# Altium project BLDC Motor Driver.PrjPcb (part 2 of 2)

## Sheet User - User Interface.SchDoc: [22] User - User Interface
size A4; ApprovedBy: Nagy Richard; CheckedBy: Nagy Richard; Author: Nagy Richard; CompanyName: EmbedCore; DrawnBy: Nagy Richard; Engineer: Nagy Richard; Organization: EmbedCore; DocumentNumber: 22; Revision: 1.0; SheetNumber: 22; SheetTotal: 22
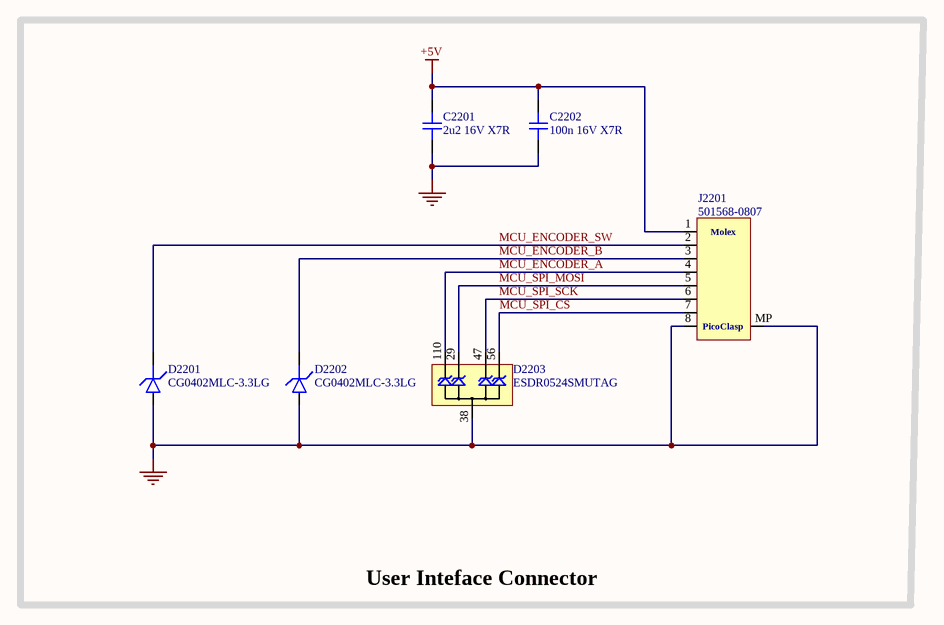
[diagram p19: User - User Interface.SchDoc]

### Parts
C2201  2u2 16V X7R  [CAP_0603]
C2202  100n 16V X7R  [CAP_0402]
D2201  CG0402MLC-3.3LG  [D_0402]
D2202  CG0402MLC-3.3LG  [D_0402]
D2203  ESDR0524SMUTAG  [uDFN-10-WIDE]
J2201  501568-0807  [501568-0807]

### Blocks framed on the sheet
User Inteface Connector: C2201 C2202 D2201-D2203 J2201

### Nets
+5V: C2201.2 C2202.2 J2201.1
GND: C2201.1 C2202.1 D2201.A D2202.A D2203.38(GND) J2201.8 J2201.MP
MCU_ENCODER_A: D2203.110 J2201.4
MCU_ENCODER_B: D2202.K J2201.3
MCU_ENCODER_SW: D2201.K J2201.2
MCU_SPI_CS: D2203.56 J2201.7
MCU_SPI_MOSI: D2203.29 J2201.5
MCU_SPI_SCK: D2203.47 J2201.6

### Notes on the sheet
- Title:
- Drawn By:
- Page Contents:
- Checked By:
- Size:
- Date:
- File:
- License:
- Email:
- A4
- Number:
- Time:
- Revision:
- Sheet
- Website:
- of
- (in symbol 501568-0807) PicoClasp

### Library data of the parts
C2201 = CAP_0603: Capacitor SMD 0603; Manufacturer: YAGEO; Manufacturer Part Number: CC0603KRX7R7BB225; Distributor Link: www.lcsc.com; LCSC: C914769; Rating: *; Dielectric: *
C2202 = CAP_0402: Capacitor SMD 0402; Manufacturer: YAGEO; Manufacturer Part Number: CC0402JRX7R7BB104; Distributor Link: www.lcsc.com; LCSC: C541464; Rating: *; Dielectric: *
D2201 D2202 = D_TVS_0402: Diode TVS / ESD 0402
D2203 = ESDR0524SMUTAG: TVS Diode Array Low Capacitance ESD Protection 4-Channel (Vwork=5V, Vclamp=15V); Manufacturer: onsemi; Manufacturer Part Number: ESDR0524SMUTAG; Distributor Link: https://www.mouser.de/ProductDetail/onsemi/ESDR0524SMUTAG?qs=NJQfjRgVp6Qe%2FuopsuIgOg%3D%3D; LCSC: C890633
J2201 = 501568-0807: 1.00mm Pitch, Pico-Clasp PCB Header, Single Row, Right-Angle, Surface Mount, Tin Plated, Outer Positive Lock, 8 Circuits, Natural; Manufacturer: Molex; Manufacturer Part Number: 501568-0807

## Sheet User - User Led's.SchDoc: [23] User - User Led's
size A4; ApprovedBy: Nagy Richard; CheckedBy: Nagy Richard; Author: Nagy Richard; CompanyName: EmbedCore; DrawnBy: Nagy Richard; Engineer: Nagy Richard; Organization: EmbedCore; DocumentNumber: 23; Revision: 1.0; SheetNumber: 23; SheetTotal: 26
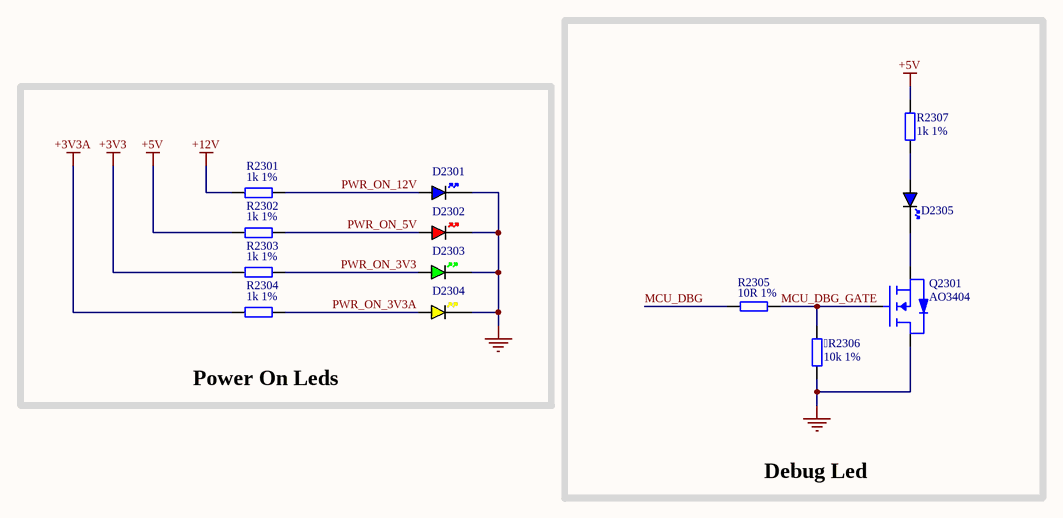
[diagram p20: User - User Led's.SchDoc]

### Parts
R2306  10k 1%  [RES_0402]
D2301  BLUE  [LED_0402_BLUE]  (value not drawn)
D2302  RED  [LED_0402_RED]  (value not drawn)
D2303  GREEN  [LED_0402_GREEN]  (value not drawn)
D2304  YELLOW  [LED_0402_YELLOW]  (value not drawn)
D2305  BLUE  [LED_0402_BLUE]  (value not drawn)
Q2301  AO3404  [SSM3J338R,LF-SOT23-F]
R2301  1k 1%  [RES_0402]
R2302  1k 1%  [RES_0402]
R2303  1k 1%  [RES_0402]
R2304  1k 1%  [RES_0402]
R2305  10R 1%  [RES_0402]
R2307  1k 1%  [RES_0402]

### Blocks framed on the sheet
Debug Led: R2306 D2305 Q2301 R2305 R2307
Power On Leds: D2301-D2304 R2301-R2304

### Nets
+3V3: R2303.1
+3V3A: R2304.1
+5V: R2302.1 R2307.2
+12V: R2301.1
GND: R2306.1 D2301.K D2302.K D2303.K D2304.K Q2301.D
MCU_DBG: R2305.2
MCU_DBG_GATE: R2306.2 Q2301.G R2305.1
PWR_ON_3V3: D2303.A R2303.2
PWR_ON_3V3A: D2304.A R2304.2
PWR_ON_5V: D2302.A R2302.2
PWR_ON_12V: D2301.A R2301.2
NetD2305_A: D2305.A R2307.1
NetD2305_K: D2305.K Q2301.S

### Notes on the sheet
- Title:
- Drawn By:
- Page Contents:
- Checked By:
- Size:
- Date:
- File:
- License:
- Email:
- A4
- Number:
- Time:
- Revision:
- Sheet
- Website:
- of

### Library data of the parts
R2306 = RES_0402: Resistor SMD 0402; Manufacturer: PANASONIC; Manufacturer Part Number: ERJPA2F1002X; Distributor Link: www.lcsc.com; LCSC: C427247
D2301 D2305 = LED_0402_BLUE: LED 0402 BLUE SMD
D2302 = LED_0402_RED: LED 0402 RED SMD
D2303 = LED_0402_GREEN: LED 0402 GREEN SMD
D2304 = LED_0402_YELLOW: LED 0402 YELLOW SMD
Q2301 = 2N7002NXAKR: MOSFET N-Channel Vds=60V Id=300mA with ESD Protection; Manufacturer: TECH PUBLIC; Manufacturer Part Number: AO3404
R2301-R2304 R2307 = RES_0402: Resistor SMD 0402; Manufacturer: PANASONIC; Manufacturer Part Number: ERJPA2J102X; Distributor Link: www.lcsc.com; LCSC: C427210
R2305 = RES_0402: Resistor SMD 0402; Manufacturer: PANASONIC; Manufacturer Part Number: ERJPA2J100X; Distributor Link: www.lcsc.com; LCSC: C427198

## Sheet Misc - Holes, Fiducials.SchDoc: [24] Misc - Holes, Fiducials
size A4; ApprovedBy: Nagy Richard; CheckedBy: Nagy Richard; Author: Nagy Richard; CompanyName: EmbedCore; DrawnBy: Nagy Richard; Engineer: Nagy Richard; Organization: EmbedCore; DocumentNumber: 24; Revision: 1.0; SheetNumber: 24; SheetTotal: 25
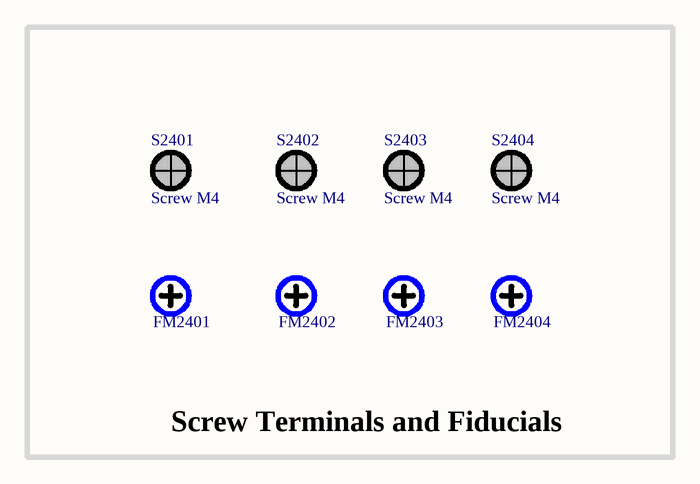
[diagram p21: Misc - Holes, Fiducials.SchDoc]

### Parts
FM2401  Fiducial Marker  [FIDUCIAL_CROSS_1MM5]  (value not drawn)  (no BOM)
FM2402  Fiducial Marker  [FIDUCIAL_CROSS_1MM5]  (value not drawn)  (no BOM)
FM2403  Fiducial Marker  [FIDUCIAL_CROSS_1MM5]  (value not drawn)  (no BOM)
FM2404  Fiducial Marker  [FIDUCIAL_CROSS_1MM5]  (value not drawn)  (no BOM)
S2401  Screw M4  [Screw M4]
S2402  Screw M4  [Screw M4]
S2403  Screw M4  [Screw M4]
S2404  Screw M4  [Screw M4]

### Blocks framed on the sheet
Screw Terminals and Fiducials: FM2401-FM2404 S2401-S2404

### Notes on the sheet
- Title:
- Drawn By:
- Page Contents:
- Checked By:
- Size:
- Date:
- File:
- License:
- Email:
- A4
- Number:
- Time:
- Revision:
- Sheet
- Website:
- of

### Library data of the parts
FM2401-FM2404 = FIDUCIAL_CROSS_1MM5: Fiducial Marker Cross 1.5mm NO BOM

## Sheet Power - Sequencing.SchDoc: [25] Power - Sequencing
size A4; ApprovedBy: Nagy Richard; CheckedBy: Nagy Richard; Author: Nagy Richard; CompanyName: EmbedCore; DrawnBy: Nagy Richard; Engineer: Nagy Richard; Organization: EmbedCore; DocumentNumber: 25; Revision: 1.0; SheetNumber: 23; SheetTotal: 24

### Notes on the sheet
- Title:
- Drawn By:
- Page Contents:
- Checked By:
- Size:
- Date:
- File:
- License:
- Email:
- A4
- Number:
- Time:
- Revision:
- Sheet
- Website:
- of

## Sheet Revision History.SchDoc: [25] Revision History
size A4; ApprovedBy: Nagy Richard; CheckedBy: Nagy Richard; Author: Nagy Richard; CompanyName: EmbedCore; DrawnBy: Nagy Richard; Engineer: Nagy Richard; Organization: EmbedCore; DocumentNumber: 25; Revision: 1.0; SheetNumber: 26; SheetTotal: 26

### Notes on the sheet
- Title:
- Drawn By:
- Page Contents:
- Checked By:
- Size:
- Date:
- File:
- License:
- Email:
- A4
- Number:
- Time:
- Revision:
- Sheet
- Website:
- of

## Nets that join several sheets
+3V3: Power Generation - Buck Converter (5 pins), MCU - Power and I_O (12 pins), Motor Control - Top Level (6 pins), Sensing - HAL Sensor (6 pins), Interface - RS485 (5 pins), Interface - CAN (C1701.2 C1702.2 U1701.3), Interface - SWD (D1901.K J1901.1), User - User Led's (R2303.1)
+3V3A: Power Generation - LDO (C605.1 U601.5), MCU - Power and I_O (C711.2 FB701.2), Sensing - Temperature (D1301.K D1302.K), User - User Led's (R2304.1)
+5V: Power Generation - Buck Converter (7 pins), Power Generation - LDO (C601.1 FB601.1), Sensing - HAL Sensor (C1501.2 C1502.2 J1501.1), Interface - Fan Control (6 pins), User - User Interface (C2201.2 C2202.2 J2201.1), User - User Led's (R2302.1 R2307.2)
+12V: Power Generation - Buck Converter (5 pins), Interface - Fan Control (6 pins), User - User Led's (R2301.1)
+VIN: Power Generation - Connector (D401.1 J401.1), Power Generation - Buck Converter (C501.2 C509.2 FB501.1 FB502.1), Motor Control - Top Level (5 pins), Motor Control - Phase A (C903.2 C904.2 Q901.D R904.2), Motor Control - Phase B (C1003.2 C1004.2 Q1001.D R1004.2), Motor Control - Phase C (C1103.2 C1104.2 Q1101.D R1104.2), Sensing - Voltage (R1201.2), Sensing - Temperature (J1301.1 R1301.2)
GND: Power Generation - Connector (D401.2 J401.2), Power Generation - Buck Converter (32 pins), Power Generation - LDO (6 pins), MCU - Power and I_O (16 pins), Motor Control - Top Level (12 pins), Motor Control - Phase A (C904.1 D903.A NT903.1 R903.1), Motor Control - Phase B (C1004.1 D1003.A NT1003.1 R1003.1), Motor Control - Phase C (C1104.1 D1103.A NT1103.1 R1103.1), Sensing - Voltage (C1201.1 R1202.1), Sensing - Temperature (6 pins), Sensing - HAL Sensor (11 pins), Interface - RS485 (11 pins), Interface - CAN (12 pins), Interface - USB-C (7 pins), Interface - SWD (D1901.A D1902.38 J1901.5), Interface - Fan Control (18 pins), User - User Interface (7 pins), User - User Led's (6 pins)
CAN_DP_N: MCU - Power and I_O (U701.58), Interface - CAN (U1701.4)
CAN_DP_P: MCU - Power and I_O (U701.59), Interface - CAN (U1701.1)
CAN_S: MCU - Power and I_O (U701.60), Interface - CAN (R1701.2 U1701.5)
CAN_SHDN: MCU - Power and I_O (U701.57), Interface - CAN (R1702.2 U1701.8)
ELEC_FAN_PWM: MCU - Power and I_O (U701.10), Interface - Fan Control (U2002.3)
HAL_MCU_A: MCU - Power and I_O (U701.39), Sensing - HAL Sensor (C1503.2 D1504.A R1501.1 R1504.1)
HAL_MCU_B: MCU - Power and I_O (U701.38), Sensing - HAL Sensor (C1504.2 D1505.A R1502.1 R1505.1)
HAL_MCU_C: MCU - Power and I_O (U701.37), Sensing - HAL Sensor (C1505.2 D1506.A R1503.1 R1506.1)
MCU_DBG: MCU - Power and I_O (U701.2), User - User Led's (R2305.2)
MCU_ENCODER_A: MCU - Power and I_O (U701.53), User - User Interface (D2203.110 J2201.4)
MCU_ENCODER_B: MCU - Power and I_O (U701.41), User - User Interface (D2202.K J2201.3)
MCU_ENCODER_SW: MCU - Power and I_O (U701.55), User - User Interface (D2201.K J2201.2)
MCU_NRST: MCU - Power and I_O (C716.2 R701.1 U701.7), Interface - SWD (R1904.1)
MCU_SOA: MCU - Power and I_O (U701.33), Motor Control - Top Level (C809.2 R804.2)
MCU_SOB: MCU - Power and I_O (U701.34), Motor Control - Top Level (C808.2 R805.2)
MCU_SOC: MCU - Power and I_O (U701.35), Motor Control - Top Level (C807.2 R806.2)
MCU_SPI_CS: MCU - Power and I_O (U701.51), User - User Interface (D2203.56 J2201.7)
MCU_SPI_MOSI: MCU - Power and I_O (U701.54), User - User Interface (D2203.29 J2201.5)
MCU_SPI_SCK: MCU - Power and I_O (U701.52), User - User Interface (D2203.47 J2201.6)
MCU_SWCLK: MCU - Power and I_O (U701.50), Interface - SWD (R1902.1)
MCU_SWDIO: MCU - Power and I_O (U701.49), Interface - SWD (R1901.1)
MCU_SWO: MCU - Power and I_O (U701.56), Interface - SWD (R1903.1)
MOSFET_TEMP: MCU - Power and I_O (U701.6), Sensing - Temperature (C1301.2 D1301.A R1301.1 R1302.2)
MOTOR_ENABLE: MCU - Power and I_O (U701.22), Motor Control - Top Level (R803.1 U801.31)
MOTOR_FAN_PWM: MCU - Power and I_O (U701.11), Interface - Fan Control (U2001.3)
MOTOR_GHA: Motor Control - Top Level (U801.6), Motor Control - Phase A (D901.K R901.1)
MOTOR_GHB: Motor Control - Top Level (U801.15), Motor Control - Phase B (D1001.K R1001.1)
MOTOR_GHC: Motor Control - Top Level (U801.16), Motor Control - Phase C (D1101.K R1101.1)
MOTOR_GLA: Motor Control - Top Level (U801.8), Motor Control - Phase A (D902.K R902.1)
MOTOR_GLB: Motor Control - Top Level (U801.13), Motor Control - Phase B (D1002.K R1002.1)
MOTOR_GLC: Motor Control - Top Level (U801.18), Motor Control - Phase C (D1102.K R1102.1)
MOTOR_nFAULT: MCU - Power and I_O (U701.30), Motor Control - Top Level (R802.1 U801.26)
MOTOR_PWM_A: MCU - Power and I_O (U701.24), Motor Control - Top Level (U801.32)
MOTOR_PWM_B: MCU - Power and I_O (U701.25), Motor Control - Top Level (U801.34)
MOTOR_PWM_C: MCU - Power and I_O (U701.26), Motor Control - Top Level (U801.36)
MOTOR_PWM_HIZ: MCU - Power and I_O (U701.23), Motor Control - Top Level (U801.33 U801.35 U801.37)
MOTOR_SA_N: Motor Control - Top Level (U801.10), Motor Control - Phase A (NT903.2)
MOTOR_SA_P: Motor Control - Top Level (U801.9), Motor Control - Phase A (NT902.2)
MOTOR_SB_N: Motor Control - Top Level (U801.11), Motor Control - Phase B (NT1003.2)
MOTOR_SB_P: Motor Control - Top Level (U801.12), Motor Control - Phase B (NT1002.2)
MOTOR_SC_N: Motor Control - Top Level (U801.20), Motor Control - Phase C (NT1103.2)
MOTOR_SC_P: Motor Control - Top Level (U801.19), Motor Control - Phase C (NT1102.2)
MOTOR_SHA: Motor Control - Top Level (U801.7), Motor Control - Phase A (NT901.1)
MOTOR_SHB: Motor Control - Top Level (U801.14), Motor Control - Phase B (NT1001.1)
MOTOR_SHC: Motor Control - Top Level (U801.17), Motor Control - Phase C (NT1101.1)
MOTOR_SPI_MISO: MCU - Power and I_O (U701.20), Motor Control - Top Level (U801.27)
MOTOR_SPI_MOSI: MCU - Power and I_O (U701.19), Motor Control - Top Level (U801.28)
MOTOR_SPI_NCS: MCU - Power and I_O (U701.18), Motor Control - Top Level (R801.1 U801.30)
MOTOR_SPI_SCK: MCU - Power and I_O (U701.21), Motor Control - Top Level (U801.29)
MOTOR_TEMP: MCU - Power and I_O (U701.9), Sensing - Temperature (C1302.2 D1302.A J1301.2 R1303.2)
PHASE_A_OUT: Motor Control - Phase A (5 pins), Interface - BLDC Connection (J2101.1)
PHASE_B_OUT: Motor Control - Phase B (5 pins), Interface - BLDC Connection (J2102.1)
PHASE_C_OUT: Motor Control - Phase C (5 pins), Interface - BLDC Connection (J2103.1)
RS485_DE: MCU - Power and I_O (U701.13), Interface - RS485 (R1602.2 U1501.3)
RS485_DP_N: MCU - Power and I_O (U701.17), Interface - RS485 (U1501.1)
RS485_DP_P: MCU - Power and I_O (U701.14), Interface - RS485 (U1501.4)
RS485_NRE: MCU - Power and I_O (U701.12), Interface - RS485 (R1601.1 U1501.2)
USB_FS_D_N: MCU - Power and I_O (U701.45), Interface - USB-C (D1801.6)
USB_FS_D_P: MCU - Power and I_O (U701.46), Interface - USB-C (D1801.4)
VSENSE_IN: MCU - Power and I_O (U701.8), Sensing - Voltage (C1201.2 R1201.1 R1202.2)